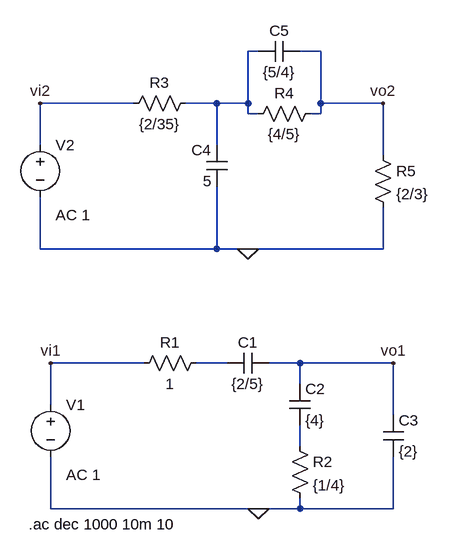
[diagram p0: schematic ej2.asc]
ej2.asc, the LTspice schematic file:
Version 4
SHEET 1 880 680
WIRE -64 -320 -80 -320
WIRE 32 -320 0 -320
WIRE -256 -240 -400 -240
WIRE -128 -240 -176 -240
WIRE -80 -240 -80 -320
WIRE -80 -240 -128 -240
WIRE 32 -240 32 -320
WIRE 128 -240 32 -240
WIRE -80 -224 -80 -240
WIRE -64 -224 -80 -224
WIRE 32 -224 32 -240
WIRE 32 -224 16 -224
WIRE -400 -176 -400 -240
WIRE -128 -176 -128 -240
WIRE 128 -160 128 -240
WIRE -400 -16 -400 -96
WIRE -128 -16 -128 -112
WIRE -128 -16 -400 -16
WIRE -80 -16 -128 -16
WIRE 128 -16 128 -80
WIRE 128 -16 -80 -16
WIRE -240 160 -384 160
WIRE -112 160 -160 160
WIRE 0 160 -48 160
WIRE 144 160 0 160
WIRE 0 192 0 160
WIRE -384 224 -384 160
WIRE 144 240 144 160
WIRE 0 288 0 256
WIRE -384 384 -384 304
WIRE -64 384 -384 384
WIRE 0 384 0 368
WIRE 0 384 -64 384
WIRE 144 384 144 304
WIRE 144 384 0 384
FLAG -384 160 vi1
FLAG 144 160 vo1
FLAG -64 384 0
FLAG -400 -240 vi2
FLAG 128 -240 vo2
FLAG -80 -16 0
SYMBOL voltage -384 208 R0
WINDOW 123 24 124 Left 2
WINDOW 39 0 0 Left 0
SYMATTR InstName V1
SYMATTR Value ""
SYMATTR Value2 AC 1
SYMBOL res -144 144 R90
WINDOW 0 0 56 VBottom 2
WINDOW 3 32 56 VTop 2
SYMATTR InstName R1
SYMATTR Value 1
SYMBOL cap -48 144 R90
WINDOW 0 0 32 VBottom 2
WINDOW 3 32 32 VTop 2
SYMATTR InstName C1
SYMATTR Value {2/5}
SYMBOL cap -16 192 R0
SYMATTR InstName C2
SYMATTR Value {4}
SYMBOL res -16 272 R0
SYMATTR InstName R2
SYMATTR Value {1/4}
SYMBOL cap 128 240 R0
SYMATTR InstName C3
SYMATTR Value {2}
SYMBOL voltage -400 -192 R0
WINDOW 123 24 124 Left 2
WINDOW 39 0 0 Left 0
SYMATTR Value2 AC 1
SYMATTR InstName V2
SYMATTR Value ""
SYMBOL res -160 -256 R90
WINDOW 0 0 56 VBottom 2
WINDOW 3 32 56 VTop 2
SYMATTR InstName R3
SYMATTR Value {2/35}
SYMBOL cap -112 -112 R180
WINDOW 0 24 56 Left 2
WINDOW 3 24 8 Left 2
SYMATTR InstName C4
SYMATTR Value 5
SYMBOL cap 0 -336 R90
WINDOW 0 0 32 VBottom 2
WINDOW 3 32 32 VTop 2
SYMATTR InstName C5
SYMATTR Value {5/4}
SYMBOL res 32 -240 R90
WINDOW 0 0 56 VBottom 2
WINDOW 3 32 56 VTop 2
SYMATTR InstName R4
SYMATTR Value {4/5}
SYMBOL res 112 -176 R0
SYMATTR InstName R5
SYMATTR Value {2/3}
TEXT -418 408 Left 2 !.ac dec 1000 10m 10

The netlist it stands for:
* ej2.asc
V1 vi1 0 AC 1
R1 N002 vi1 1
C1 vo1 N002 {2/5}
C2 vo1 N003 {4}
R2 N003 0 {1/4}
C3 vo1 0 {2}
V2 vi2 0 AC 1
R3 N001 vi2 {2/35}
C4 0 N001 5
C5 vo2 N001 {5/4}
R4 vo2 N001 {4/5}
R5 vo2 0 {2/3}
.ac dec 1000 10m 10
.backanno
.end